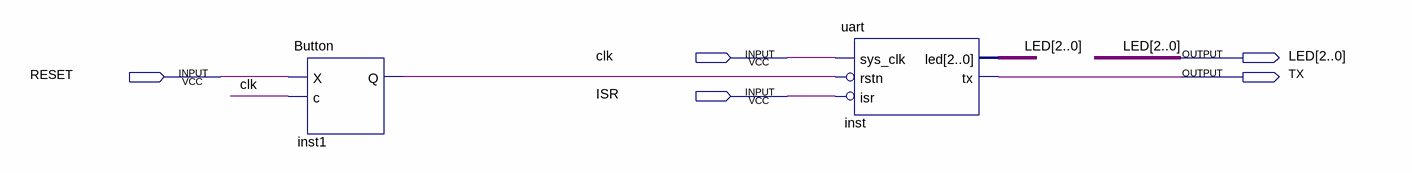
[diagram p0: schematic sheet]
// Quartus schematic main.bdf as structural Verilog: 2 symbols, 5 pins
module main (
  input  clk,
  input  RESET,
  input  ISR,
  output [2:0] LED,
  output TX
);

  wire inst1_q;

  Button inst1 (.X(RESET), .c(clk), .Q(inst1_q));
  uart inst (.sys_clk(clk), .rstn(~inst1_q), .isr(~ISR), .led(LED), .tx(TX));
endmodule
